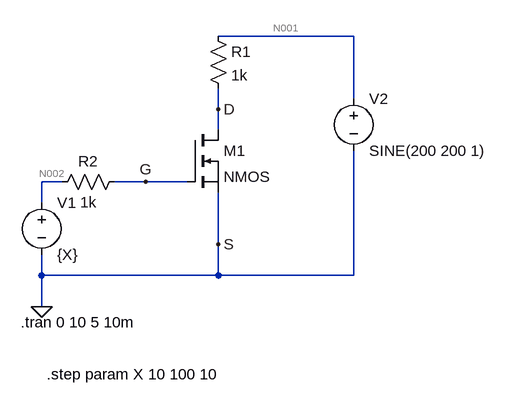
[diagram p0: schematic nmos.asc]
nmos.asc, the LTspice schematic file:
Version 4
SHEET 1 880 680
WIRE 416 -64 208 -64
WIRE 416 32 416 -64
WIRE 208 48 208 16
WIRE 208 80 208 48
WIRE -32 160 -64 160
WIRE 96 160 48 160
WIRE 160 160 96 160
WIRE -64 192 -64 160
WIRE 208 256 208 176
WIRE -64 304 -64 272
WIRE 208 304 208 256
WIRE 208 304 -64 304
WIRE 416 304 416 112
WIRE 416 304 208 304
WIRE -64 352 -64 304
FLAG -64 352 0
FLAG 208 48 D
FLAG 208 256 S
FLAG 96 160 G
SYMBOL voltage -64 176 R0
WINDOW 123 0 0 Left 2
WINDOW 39 0 0 Left 2
SYMATTR InstName V1
SYMATTR Value {X}
SYMBOL res 192 -80 R0
SYMATTR InstName R1
SYMATTR Value 1k
SYMBOL voltage 416 16 R0
WINDOW 123 0 0 Left 2
WINDOW 39 0 0 Left 2
SYMATTR InstName V2
SYMATTR Value SINE(200 200 1)
SYMBOL res 64 144 R90
WINDOW 0 0 56 VBottom 2
WINDOW 3 32 56 VTop 2
SYMATTR InstName R2
SYMATTR Value 1k
SYMBOL nmos 160 80 R0
SYMATTR InstName M1
TEXT -96 376 Left 2 !.tran 0 10 5 10m
TEXT -56 456 Left 2 !.step param X 10 100 10

The netlist it stands for:
* nmos.asc
V1 N002 0 {X}
R1 N001 D 1k
V2 N001 0 SINE(200 200 1)
R2 G N002 1k
M1 D G 0 0 NMOS
.model NMOS NMOS
.model PMOS PMOS
.lib standard.mos
.tran 0 10 5 10m
.step param X 10 100 10
.backanno
.end

* Results of the author's LTspice run, read from the files saved beside the schematic
* Operating Point (first step), zero values left out:
*   x = 10 
*   V(n002) = 10 V
*   V(n001) = 200 V
*   V(d) = 199 V
*   V(g) = 10 V
*   Id(M1) = 1 mA
*   Ib(M1) = -199 pA
*   Is(M1) = -1 mA
*   I(R1) = 1 mA
*   I(V2) = -1 mA
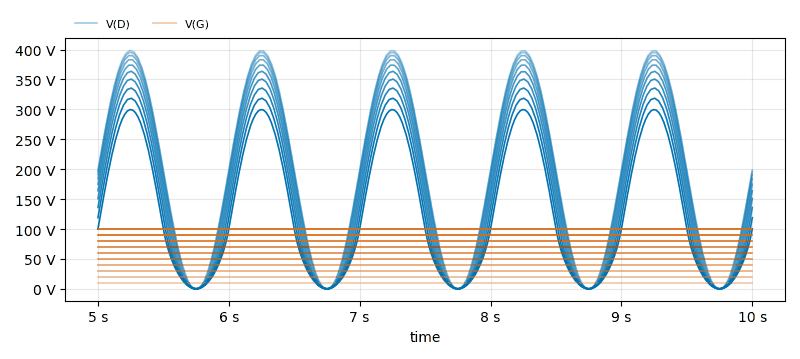
[diagram p1: Transient Analysis of nmos.asc, plotted from the saved traces]
* Transient Analysis, 19 runs:
*   V(D) [run 1]: min 247.8 mV, max 398.7 V, average 198.9 V, rms 244.6 V, last 199 V
*   V(D) [run 2]: 196 V at time=5 s, 196 V at time=5 s, min 196 V, max 196 V
*   V(D) [run 3]: min 212.1 mV, max 395.7 V, average 196.2 V, rms 242 V, last 196 V
*   V(D) [run 4]: 191 V at time=5 s, 191 V at time=5 s, min 191 V, max 191 V
*   V(D) [run 5]: min 185.5 mV, max 389.9 V, average 191.9 V, rms 238 V, last 191 V
*   V(D) [run 6]: min 164.8 mV, max 382.9 V, average 186 V, rms 232.4 V, last 184 V
*   V(D) [run 7]: 175 V at time=5 s, 175 V at time=5 s, min 175 V, max 175 V
*   V(D) [run 8]: min 148.2 mV, max 373.9 V, average 178.9 V, rms 225.3 V, last 175 V
*   V(G) [run 1]: min 10 V, max 10 V, average 10 V, rms 10 V, last 10 V
*   V(G) [run 2]: 20 V at time=5 s, 20 V at time=5 s, min 20 V, max 20 V
*   V(G) [run 3]: min 20 V, max 20 V, average 20 V, rms 20 V, last 20 V
*   V(G) [run 4]: 30 V at time=5 s, 30 V at time=5 s, min 30 V, max 30 V
*   V(G) [run 5]: min 30 V, max 30 V, average 30 V, rms 30 V, last 30 V
*   V(G) [run 6]: min 40 V, max 40 V, average 40 V, rms 40 V, last 40 V
*   V(G) [run 7]: 50 V at time=5 s, 50 V at time=5 s, min 50 V, max 50 V
*   V(G) [run 8]: min 50 V, max 50 V, average 50 V, rms 50 V, last 50 V